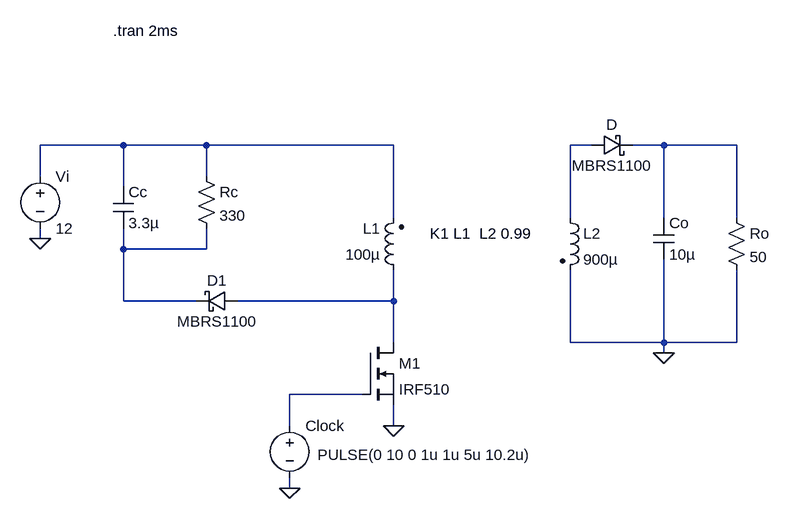
[diagram p0: schematic Flyback_clamp.asc]
Flyback_clamp.asc, the LTspice schematic file:
Version 4.1
SHEET 1 880 680
WIRE -368 -64 -496 -64
WIRE -240 -64 -368 -64
WIRE 48 -64 -240 -64
WIRE 352 -64 320 -64
WIRE 464 -64 416 -64
WIRE 576 -64 464 -64
WIRE -496 -16 -496 -64
WIRE -240 -16 -240 -64
WIRE -368 0 -368 -64
WIRE 48 48 48 -64
WIRE 320 48 320 -64
WIRE 464 48 464 -64
WIRE 576 48 576 -64
WIRE -496 80 -496 64
WIRE -368 96 -368 64
WIRE -240 96 -240 64
WIRE -240 96 -368 96
WIRE -368 176 -368 96
WIRE -256 176 -368 176
WIRE 48 176 48 128
WIRE 48 176 -192 176
WIRE 48 240 48 176
WIRE 320 240 320 128
WIRE 464 240 464 112
WIRE 464 240 320 240
WIRE 576 240 576 128
WIRE 576 240 464 240
WIRE 464 256 464 240
WIRE 0 320 -112 320
WIRE -112 368 -112 320
WIRE 48 368 48 336
WIRE -112 464 -112 448
FLAG -496 80 0
FLAG 48 368 0
FLAG 464 256 0
FLAG -112 464 0
SYMBOL cap 448 48 R0
SYMATTR InstName Co
SYMATTR Value 10µ
SYMBOL res 560 32 R0
SYMATTR InstName Ro
SYMATTR Value 50
SYMBOL voltage -112 352 R0
WINDOW 123 0 0 Left 2
WINDOW 39 0 0 Left 2
WINDOW 3 43 61 Left 2
SYMATTR InstName Clock
SYMATTR Value PULSE(0 10 0 1u 1u 5u 10.2u)
SYMBOL voltage -496 -32 R0
WINDOW 123 0 0 Left 2
WINDOW 39 0 0 Left 2
SYMATTR InstName Vi
SYMATTR Value 12
SYMBOL schottky 352 -80 M90
WINDOW 0 0 32 VBottom 2
WINDOW 3 32 32 VTop 2
SYMATTR InstName D
SYMATTR Value MBRS1100
SYMATTR Description Diode
SYMATTR Type diode
SYMBOL ind2 64 144 R180
WINDOW 0 36 80 Left 2
WINDOW 3 36 40 Left 2
SYMATTR InstName L1
SYMATTR Value 100µ
SYMBOL ind2 304 32 R0
SYMATTR InstName L2
SYMATTR Value 900µ
SYMBOL nmos 0 240 R0
SYMATTR InstName M1
SYMATTR Value IRF510
SYMBOL schottky -192 192 M270
WINDOW 0 32 32 VTop 2
WINDOW 3 0 32 VBottom 2
SYMATTR InstName D1
SYMATTR Value MBRS1100
SYMATTR Description Diode
SYMATTR Type diode
SYMBOL cap -384 0 R0
SYMATTR InstName Cc
SYMATTR Value 3.3µ
SYMBOL res -256 -32 R0
SYMATTR InstName Rc
SYMATTR Value 330
TEXT -384 -240 Left 2 !.tran 2ms
TEXT 104 72 Left 2 !K1 L1  L2 0.99

The netlist it stands for:
* Flyback_clamp.asc
Co N003 0 10µ
Ro N003 0 50
V§Clock N006 0 PULSE(0 10 0 1u 1u 5u 10.2u)
Vi N001 0 12
D N002 N003 MBRS1100
L1 N005 N001 100µ
L2 N002 0 900µ
M1 N005 N006 0 0 IRF510
D1 N005 N004 MBRS1100
Cc N001 N004 3.3µ
Rc N001 N004 330
.model D D
.lib standard.dio
.model NMOS NMOS
.model PMOS PMOS
.lib standard.mos
.tran 2ms
K1 L1  L2 0.99
.backanno
.end